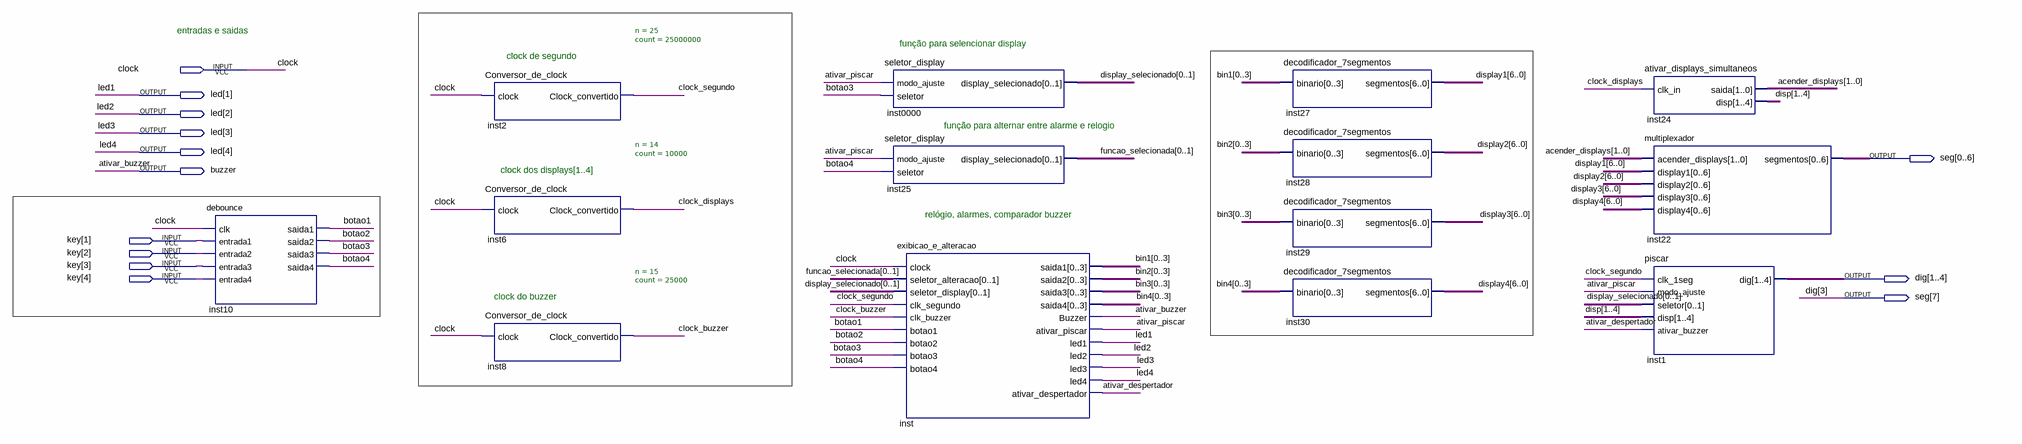
[diagram p0: schematic sheet]
// Quartus schematic teste0.bdf as structural Verilog: 14 symbols, 13 pins
module teste0 (
  input  clock,
  input  [4:1] key,
  output [4:1] led,
  output [0:7] seg,
  output buzzer,
  output [1:4] dig
);

  wire ativar_despertador, ativar_piscar, botao1, botao2, botao3, botao4, clock_buzzer, clock_displays,
       clock_segundo;
  wire [1:0] acender_displays, display_selecionado, funcao_selecionada;
  wire [3:0] bin1, bin2, bin3, bin4;
  wire [4:1] disp;
  wire [6:0] display1, display2, display3, display4;

  debounce inst10 (
    .clk(clock), .entrada1(key[1]), .entrada2(key[2]), .entrada3(key[3]), .entrada4(key[4]), .saida1(botao1),
    .saida2(botao2), .saida3(botao3), .saida4(botao4));
  Conversor_de_clock #(.n(25), .count(25000000)) inst2 (.clock(clock), .Clock_convertido(clock_segundo));
  Conversor_de_clock #(.n(14), .count(10000)) inst6 (.clock(clock), .Clock_convertido(clock_displays));
  Conversor_de_clock #(.n(15), .count(25000)) inst8 (.clock(clock), .Clock_convertido(clock_buzzer));
  seletor_display inst0000 (
    .modo_ajuste(ativar_piscar), .seletor(botao3),
    .display_selecionado({display_selecionado[0], display_selecionado[1]}));
  seletor_display inst25 (
    .modo_ajuste(ativar_piscar), .seletor(botao4),
    .display_selecionado({funcao_selecionada[0], funcao_selecionada[1]}));
  exibicao_e_alteracao inst (
    .clock(clock), .seletor_alteracao({funcao_selecionada[0], funcao_selecionada[1]}),
    .seletor_display({display_selecionado[0], display_selecionado[1]}), .clk_segundo(clock_segundo),
    .clk_buzzer(clock_buzzer), .botao1(botao1), .botao2(botao2), .botao3(botao3), .botao4(botao4),
    .saida1({bin1[0], bin1[1], bin1[2], bin1[3]}), .saida2({bin2[0], bin2[1], bin2[2], bin2[3]}),
    .saida3({bin3[0], bin3[1], bin3[2], bin3[3]}), .saida4({bin4[0], bin4[1], bin4[2], bin4[3]}),
    .Buzzer(buzzer), .ativar_piscar(ativar_piscar), .led1(led[1]), .led2(led[2]), .led3(led[3]),
    .led4(led[4]), .ativar_despertador(ativar_despertador));
  decodificador_7segmentos inst27 (.binario({bin1[0], bin1[1], bin1[2], bin1[3]}), .segmentos(display1));
  decodificador_7segmentos inst28 (.binario({bin2[0], bin2[1], bin2[2], bin2[3]}), .segmentos(display2));
  decodificador_7segmentos inst29 (.binario({bin3[0], bin3[1], bin3[2], bin3[3]}), .segmentos(display3));
  decodificador_7segmentos inst30 (.binario({bin4[0], bin4[1], bin4[2], bin4[3]}), .segmentos(display4));
  ativar_displays_simultaneos inst24 (
    .clk_in(clock_displays), .saida(acender_displays), .disp({disp[1], disp[2], disp[3], disp[4]}));
  multiplexador inst22 (
    .acender_displays(acender_displays), .display1(display1), .display2(display2), .display3(display3),
    .display4(display4), .segmentos(seg[0:6]));
  piscar inst1 (
    .clk_1seg(clock_segundo), .modo_ajuste(ativar_piscar),
    .seletor({display_selecionado[0], display_selecionado[1]}), .disp({disp[1], disp[2], disp[3], disp[4]}),
    .ativar_buzzer(ativar_despertador), .dig(dig));

  assign seg[7] = dig[3];

  // Other names for the same wires on the sheet: ativar_buzzer = buzzer

  // Notes on the sheet:
  //   entradas e saidas
  //   função para selencionar display
  //   clock de segundo
  //   função para alternar entre alarme e relogio
  //   clock dos displays[1..4]
  //   relógio, alarmes, comparador buzzer
  //   clock do buzzer
endmodule
